# EAGLE schematic LOG-DIGITAL (EAGLE 6.1)
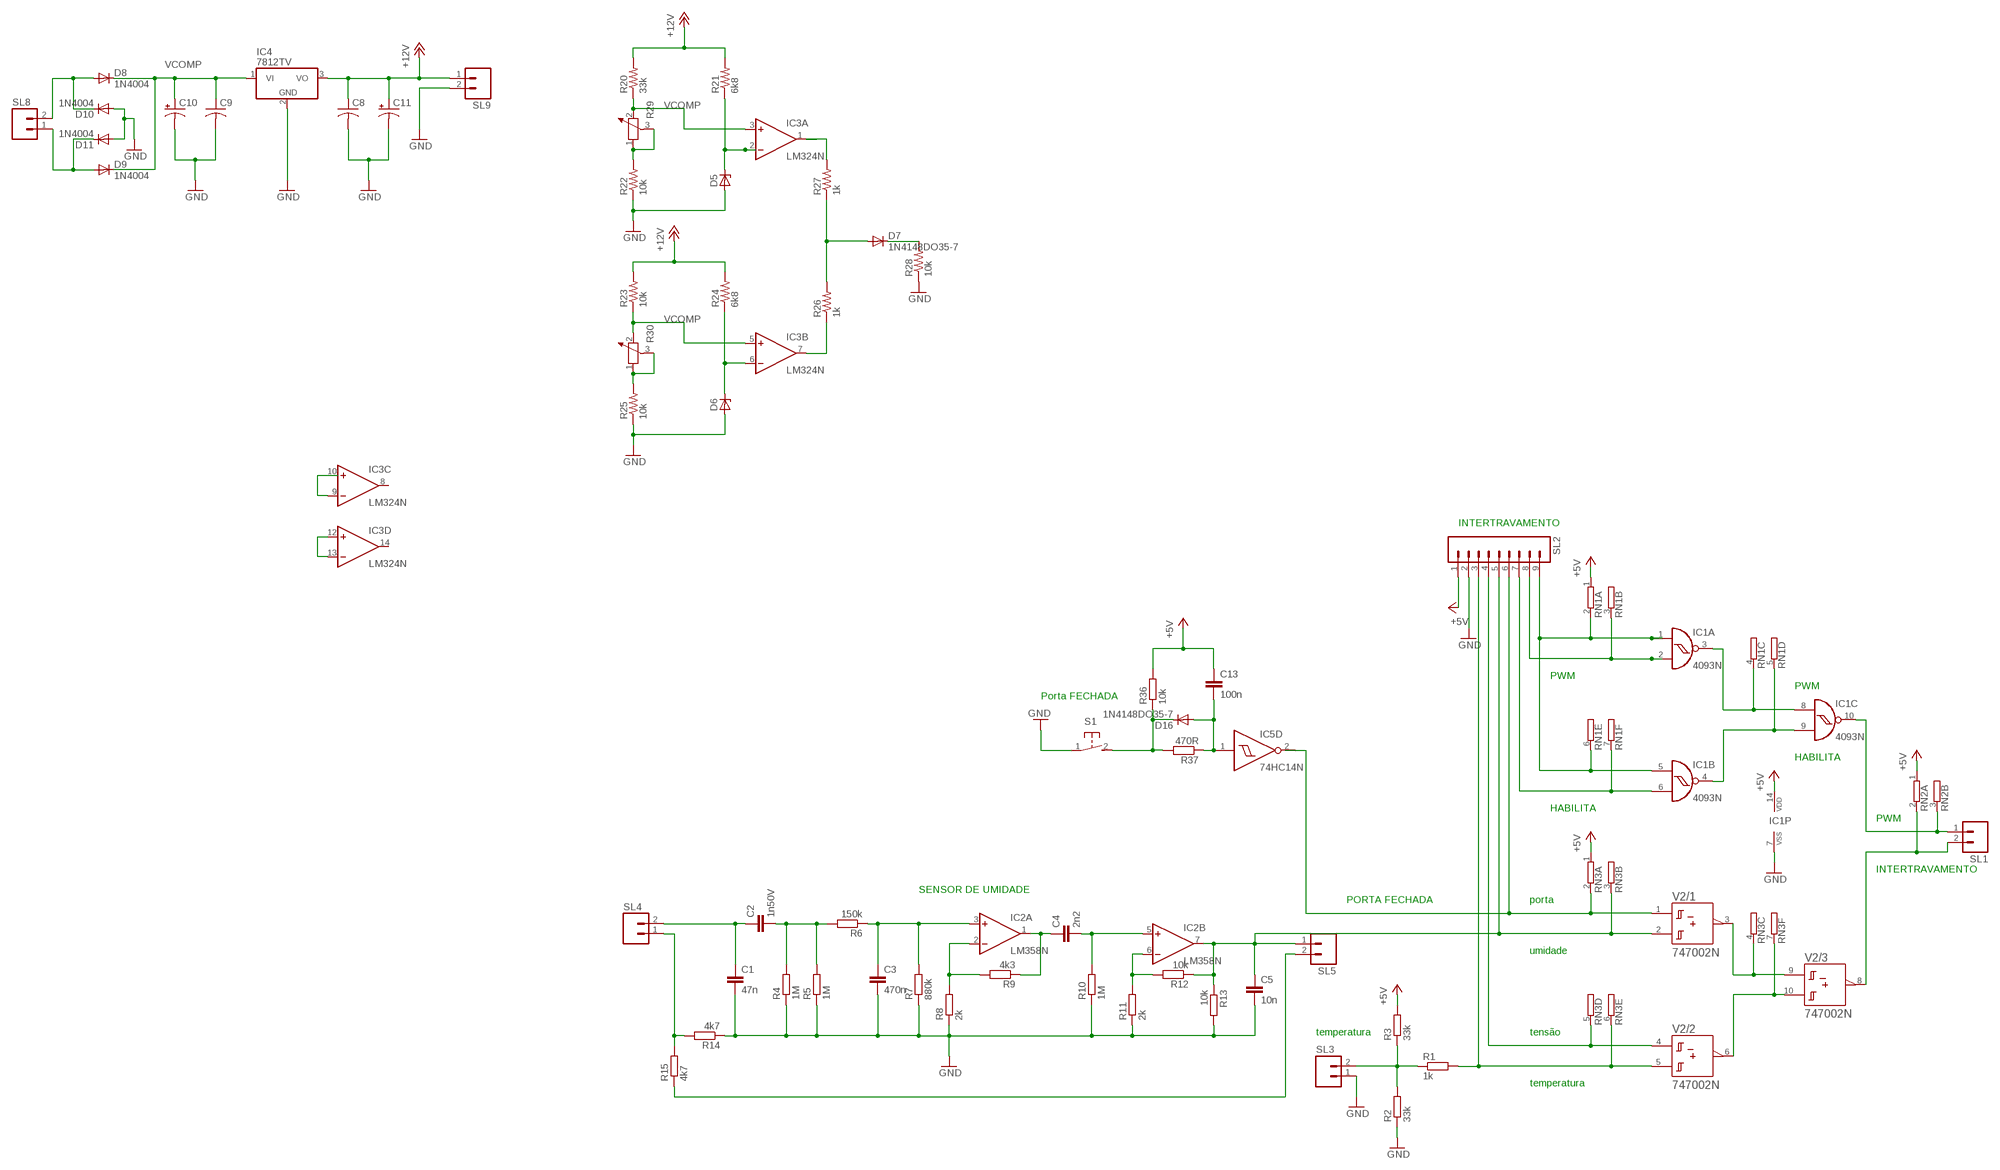
[diagram p0: schematic, sheet 1]

## Parts
C1  47n  C-EU050-025X075  [C050-025X075@1]
C2  1n50V  C-EU050-025X075  [C050-025X075@1]
C3  470n  C-EU050-025X075  [C050-025X075@1]
C4  2n2  C-EU050-025X075  [C050-025X075@1]
C5  10n  C-EU050-025X075  [C050-025X075@1]
C8  C-US050-030X075  [C050-030X075]
C9  C-US050-030X075  [C050-030X075]
C10  CPOL-USE2.5-6  [E2,5-6]
C11  CPOL-USE2.5-6  [E2,5-6]
C13  100n  C5/3  [C5B3]
D5  ZENER-DIODEZD-7.5  [ZDIO-7.5]
D6  ZENER-DIODEZD-7.5  [ZDIO-7.5]
D7  1N4148DO35-7  [DO35-7]
D8  1N4004  [DO41-10]
D9  1N4004  [DO41-10]
D10  1N4004  [DO41-10]
D11  1N4004  [DO41-10]
D16  1N4148DO35-7  [DO35-7]
IC1  4093N  [DIL14]
IC2  LM358N  [DIL08]
IC3  LM324N  [DIL14]
IC4  7812TV  [TO220V]
IC5  74HC14N  [DIL14]
R1  1k  R-EU_0204/7  [0204/7]
R2  33k  R-EU_0204/7  [0204/7]
R3  33k  R-EU_0204/7  [0204/7]
R4  1M  R-EU_0204/7  [0204/7]
R5  1M  R-EU_0204/7  [0204/7]
R6  150k  R-EU_0204/7  [0204/7]
R7  880k  R-EU_0204/7  [0204/7]
R8  2k  R-EU_0204/7  [0204/7]
R9  4k3  R-EU_0204/7  [0204/7]
R10  1M  R-EU_0204/7  [0204/7]
R11  2k  R-EU_0204/7  [0204/7]
R12  10k  R-EU_0204/7  [0204/7]
R13  10k  R-EU_0204/7  [0204/7]
R14  4k7  R-EU_0204/7  [0204/7]
R15  4k7  R-EU_0204/7  [0204/7]
R20  33k  R-US_0204/7  [0204/7]
R21  6k8  R-US_0204/7  [0204/7]
R22  10k  R-US_0204/7  [0204/7]
R23  10k  R-US_0204/7  [0204/7]
R24  6k8  R-US_0204/7  [0204/7]
R25  10k  R-US_0204/7  [0204/7]
R26  1k  R-US_0204/7  [0204/7]
R27  1k  R-US_0204/7  [0204/7]
R28  10k  R-US_0204/7  [0204/7]
R29  POTENTIOMETER_PT-10S  [PT-10S]
R30  POTENTIOMETER_PT-10S  [PT-10S]
R36  10k  R-EU_0207/10  [0207/10]
R37  470R  R-EU_0207/10  [0207/10]
RN1  GE06R  [SIL7]
RN2  GE03R  [SIL4]
RN3  GE06R  [SIL7]
S1  31-XX  [B3F-31XX]
SL1  M02  [02P]
SL2  M09  [09P]
SL3  M02  [02P]
SL4  M02  [02P]
SL5  M02  [02P]
SL8  M02  [02P]
SL9  M02  [02P]
V2  747002N  [DIL14]

## Nets
+5V: C13.1 IC1.14(P:VDD) R3.2 R36.2 RN1.1 RN2.1 RN3.1 SL2.1
+12V: C8.1 C11.+ IC4.3(VO) R20.2 R21.2 R23.2 R24.2 SL9.1
GND: C1.2 C3.2 C5.2 C8.2 C9.2 C10.- C11.- D5.A D6.A D10.A D11.A IC1.7(P:VSS) IC4.2(GND) R2.1 R4.1 R5.1 R7.1 R8.1 R10.1 R11.1 R13.2 R14.1 R22.1 R25.1 R28.1 S1.1(P) SL2.2 SL3.1 SL9.2
N$1: R1.1 R2.2 R3.1 SL3.2
N$2: C1.1 C2.1 SL4.2
N$3: C2.2 R4.2 R5.2 R6.2
N$4: R14.2 R15.2 SL4.1
N$5: C3.1 IC2.3(A:+IN) R6.1 R7.2
N$6: R15.1 SL5.2
N$7: IC2.2(A:-IN) R8.2 R9.2
N$8: C4.1 IC2.1(A:OUT) R9.1
N$10: C4.2 IC2.5(B:+IN) R10.2
N$11: IC2.6(B:-IN) R11.2 R12.2
N$16: R25.2 R30.1 R30.3
N$19: R22.2 R29.1 R29.3
N$20: SL2.7
N$22: D5.C IC3.2(A:-IN) R21.1
N$23: IC1.2(A:I1) RN1.3 SL2.8
N$24: D6.C IC3.6(B:-IN) R24.1
N$26: IC3.7(B:OUT) R26.1
N$27: IC3.1(A:OUT) R27.2
N$28: D7.A R26.2 R27.1
N$29: IC3.9(C:-IN)
N$30: IC3.12(D:+IN) IC3.13(D:-IN)
N$32: D8.A D10.C SL8.2
N$33: D9.A D11.C SL8.1
N$43: RN3.4 V2.3(/1:Y) V2.9(/3:A)
N$44: RN3.7 V2.6(/2:Y) V2.10(/3:B)
N$45: IC1.3(A:O) IC1.8(C:I0) RN1.4
N$46: IC1.4(B:O) IC1.9(C:I1) RN1.5
N$47: IC1.10(C:O) RN2.3 SL1.1
N$48: RN2.2 SL1.2 V2.8(/3:Y)
N$50: D16.C R36.1 R37.2 S1.2(S)
N$51: C13.2 D16.A IC5.1(D:I) R37.1
N$57: IC5.2(D:O) RN3.2 SL2.6 V2.1(/1:A)
N$61: IC1.6(B:I1) RN1.7
N$63: C5.1 IC2.7(B:OUT) R12.1 R13.1 RN3.3 SL2.5 SL5.1 V2.2(/1:B)
N$65: R1.2 RN3.6 SL2.3 V2.5(/2:B)
N$66: IC1.1(A:I0) IC1.5(B:I0) RN1.2 RN1.6 SL2.9
SUBSOBRETENSAO: D7.C R28.2 RN3.5 SL2.4 V2.4(/2:A)
VCOMP: C9.1 C10.+ D8.C D9.C IC3.3(A:+IN) IC3.5(B:+IN) IC4.1(VI) R20.1 R23.1 R29.2 R30.2
Unconnected: IC1.11(D:O) IC1.12(D:I0) IC1.13(D:I1) IC3.8(C:OUT) IC3.10(C:+IN) IC3.14(D:OUT) IC5.3(E:I) IC5.4(E:O) IC5.5(F:I) IC5.6(F:O) IC5.8(C:O) IC5.9(C:I) IC5.10(B:O) IC5.11(B:I) IC5.12(A:O) IC5.13(A:I) RN2.4 V2.11(/4:Y) V2.12(/4:A) V2.13(/4:B)

## Notes on the sheet
- INTERTRAVAMENTO
- PWM
- PWM
- Porta FECHADA
- HABILITA
- HABILITA
- PWM
- INTERTRAVAMENTO
- SENSOR DE UMIDADE
- PORTA FECHADA | porta
- umidade
- temperatura | tensão
- temperatura

## Power pins joined to a net without a drawn wire
+UB: V2.14(/+UB:+UB)
-UB: V2.7(/-UB:-UB)
GND: IC5.7(P:GND)
V+: IC2.8(P:V+) IC3.4(P:V+)
V-: IC2.4(P:V-) IC3.11(P:V-)
VCC: IC5.14(P:VCC)

## Library data of the parts
C1-C5 = rcl:C-EU: CAPACITOR, European symbol
C8 C9 = rcl:C-US: CAPACITOR, American symbol
C10 C11 = rcl:CPOL-US: POLARIZED CAPACITOR, American symbol
C13 = capacitor-wima:C: CAPACITOR naming: grid - package width
D5 D6 = diode:ZENER-DIODE: Z-Diode
D7 D16 = diode:1N4148: DIODE high speed (Philips)
D8-D11 = diode:1N4004: DIODE general purpose rectifier, 1 A
IC1 = 40xx:4093: Quad 2-input NAND schmitt trigger
IC2 = linear:LM358: OP AMP also LM158; LM258; LM2904 Source: http://cache.national.com/ds/LM/LM158.pdf
IC3 = linear:LM324: OP AMP
IC4 = linear:78*: Positive VOLTAGE REGULATOR Source: http://cache.national.com/ds/LM/LM78L05.pdf http://www.fairchildsemi.com/ds/LM/LM7805.pdf
IC5 = 74xx-eu:74*14: Hex schmitt trigger INVERTER
R1-R15 R36 R37 = rcl:R-EU_: RESISTOR, European symbol
R20-R28 = rcl:R-US_: RESISTOR, American symbol
R29 R30 = rcl:POTENTIOMETER_: Potentiometer
RN1 RN3 = resistor-sil:GE06R: SIL RESISTOR; OC_FARNELL: unknown; OC_NEWARK: unknown
RN2 = resistor-sil:GE03R: SIL RESISTOR; OC_FARNELL: unknown; OC_NEWARK: unknown
S1 = switch-omron:31-XX: OMRON SWITCH; MPN: B3F-3100; OC_FARNELL: 959704; OC_NEWARK: 36M3582
SL1 SL3-SL5 SL8 SL9 = con-amp-quick:M02: AMP QUICK CONNECTOR; OC_FARNELL: unknown; OC_NEWARK: unknown
SL2 = con-amp-quick:M09: AMP QUICK CONNECTOR; OC_FARNELL: unknown; OC_NEWARK: unknown
V2 = 74ttl-din:74*7002: Quad NOR, schmitt trigger